# Altium schematic sheet RF_Power.SchDoc
size A4
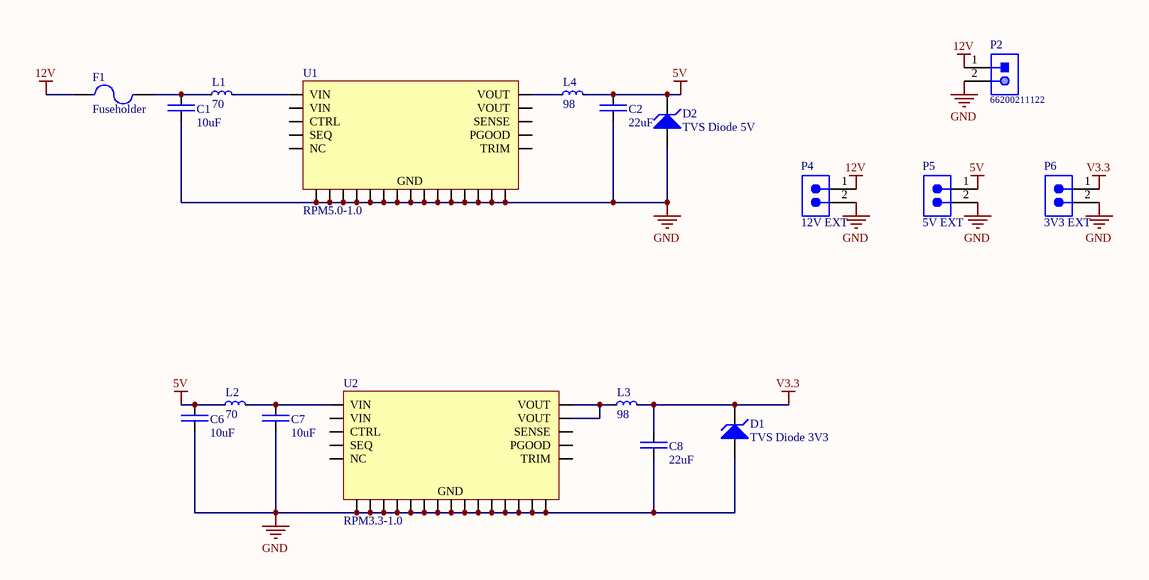
[diagram p0: RF_Power.SchDoc]

## Parts
C1  10uF  [1206]
C2  22uF  [1206]
C6  10uF  [1206]
C7  10uF  [1206]
C8  22uF  [1206]
D1  TVS Diode 3V3  [SOD-323]
D2  TVS Diode 5V  [SOD-323]
F1  Fuseholder  [SCHURTER - 0031.7701.11 - FUSE HOLDER, PCB MOUNT]
L1  70  [1812]
L2  70  [1812]
L3  98  [7427932]
L4  98  [7427932]
P2  66200211122  [66200211122]
P4  12V EXT  [SMTC-TSW-102-26-XX-S]
P5  5V EXT  [SMTC-TSW-102-26-XX-S]
P6  3V3 EXT  [SMTC-TSW-102-26-XX-S]
U1  RPM5.0-1.0  [25-BLGA]
U2  RPM3.3-1.0  [25-BLGA]

## Nets
5V: C2.2 C6.1 D2.2(K) L2.1 L4.2 P5.1
12V: F1.1 P2.1 P4.1
GND: C1.2 C2.1 C6.2 C7.1 C8.1 D1.1(A) D2.1(A) P2.2 P4.2 P5.2 P6.2 U1.A3(GND) U1.A4(GND) U1.B1(GND) U1.B2(GND) U1.B3(GND) U1.B4(GND) U1.C2(GND) U1.C3(GND) U1.C4(GND) U1.D2(GND) U1.D3(GND) U1.D4(GND) U1.D5(GND) U1.E3(GND) U1.E4(GND) U2.A3(GND) U2.A4(GND) U2.B1(GND) U2.B2(GND) U2.B3(GND) U2.B4(GND) U2.C2(GND) U2.C3(GND) U2.C4(GND) U2.D2(GND) U2.D3(GND) U2.D4(GND) U2.D5(GND) U2.E3(GND) U2.E4(GND)
V3.3: C8.2 D1.2(K) L3.2 P6.1
NetC1_1: C1.1 F1.2 L1.1
NetC7_2: C7.2 L2.2 U2.A1(VIN)
NetL1_2: L1.2 U1.A1(VIN)
NetL3_1: L3.1 U2.A5(VOUT) U2.B5(VOUT)
NetL4_1: L4.1 U1.A5(VOUT)

Not connected (* = marked no-connect by the designer): U1 A2(VIN) B5(VOUT) C1(CTRL) C5(SENSE) D1(PGOOD) E1(SEQ) E2(NC) E5(TRIM); U2 A2(VIN) C1(CTRL) C5(SENSE) D1(PGOOD) E1(SEQ) E2(NC) E5(TRIM)

## Library data of the parts
C1 C6 C7 = CL31B106KAHNFNE: CAP CER 10UF 25V X7R 1206; Manufacturer: Samsung; Tolerance: 10%; Supplier 1: Digi-Key; Supplier Part Number 1: 1276-3100-1-ND; Manufacturer Part Number: CL31B106KAHNFNE; RoHS: Yes; Category: Ceramic Capacitors; Stock 1: 1201; Mount: Surface Mount; Case/Package: 1206; Case Code (Metric): 3216; Case Code (Imperial): 1206; Min Operating Temperature: -55°C; Max Operating Temperature: 125°C; Package Quantity: 1; Packaging: Tape and Reel; Capacitance: 10uF; Voltage Rating: 25V; Dielectric: X7R; Length: 3.2mm; Height: 1.6mm; Width: 0.063inch; Thickness: 0.071inch; Depth: 1.6mm; Radiation Hardening: No; Lead Free: Lead Free; ComponentLink1URL: https://datasheet.ciiva.com/25795/cl31b106kahnfne-25795136.pdf?src-supplier=Digi-Key; ComponentLink1Description: https://datasheet.ciiva.com/25795/cl31b106kahnfne-25795136.pdf?src-supplier=Digi-Key
C2 C8 = CL31B226KPHNNNE: CAP CER 22UF 10V X7R 1206; Manufacturer: Samsung; Tolerance: 10%; Supplier 1: Digi-Key; Supplier Part Number 1: 1276-2769-1-ND; Manufacturer Part Number: CL31B226KPHNNNE; RoHS: Yes; Category: Ceramic Capacitors; Stock 1: 617814; Mount: Surface Mount; Case/Package: 1206; Case Code (Metric): 3216; Case Code (Imperial): 1206; Contact Plating: Tin; Min Operating Temperature: -55°C; Max Operating Temperature: 125°C; Package Quantity: 2000; Packaging: Tape and Reel; Capacitance: 22uF; Voltage Rating: 10V; Dielectric: X7R; Voltage Rating (DC): 10V; Termination: Wraparound; Length: 3.2mm; Thickness: 0.071inch; Width: 0.063inch; Depth: 1.6mm; Radiation Hardening: No; Lead Free: Lead Free; ComponentLink1URL: https://datasheet.ciiva.com/25724/cl31b226kphnnne-25724443.pdf?src-supplier=Digi-Key; ComponentLink1Description: https://datasheet.ciiva.com/25724/cl31b226kphnnne-25724443.pdf?src-supplier=Digi-Key; ComponentLink2URL: https://datasheet.ciiva.com/16384/cl31b226kphnnne-16384588.pdf?src-supplier=Future+Electronics; ComponentLink2Description: https://datasheet.ciiva.com/16384/cl31b226kphnnne-16384588.pdf?src-supplier=Future+Electronics; ComponentLink3URL: https://datasheet.ciiva.com/26838/getdatasheetpartid-710483-26838941.pdf?src-supplier=Verical; ComponentLink3Description: https://datasheet.ciiva.com/26838/getdatasheetpartid-710483-26838941.pdf?src-supplier=Verical
D1 = CDSOD323-T03S: ESD Suppressor TVS ±30kV 2-Pin SOD-323 T/R; Manufacturer: Bourns; Direction: Unidirectional; Operating Supply Voltage: 3.3V; Max Surge Current: 43A; Capacitance: 500pF; Number of Unidirectional Channels: 1; Min Breakdown Voltage: 4V; Clamping Voltage: 10.9V; Peak Pulse Power: 500W; Power Line Protection: No; Leakage Current: 125uA; Element Configuration: Single; Supplier 1: Digi-Key; Supplier Part Number 1: CDSOD323-T03SCT-ND; Manufacturer Part Number: CDSOD323-T03S; Stock 1: 99362; Pricing 1: 1 = 0.72000, 10 = 0.60600, 25 = 0.53000, 100 = 0.45420, 250 = 0.39368, 500 = 0.33310, 1000 = 0.25740 (USD); RoHS: Yes; Mount: Surface Mount; Case/Package: SOD-323-2; Number of Pins: 2; Contact Plating: Tin; Min Operating Temperature: -55°C; Max Operating Temperature: 150°C; Packaging: Tape and Reel; Package Quantity: 3000; Reverse Standoff Voltage: 3.3V; Polarity: Unidirectional; Number of Channels: 1; Breakdown Voltage: 4V; Termination: SMD/SMT; Working Voltage: 3.3V; Max Power Dissipation: 500W; Peak Pulse Current: 43A; Composition: Zener; Length: 1.9mm; Depth: 1.45mm; Radiation Hardening: No; REACH SVHC: No SVHC; ComponentLink1URL: https://datasheet.ciiva.com/22685/1671000-22685541.pdf?src-supplier=Element14; ComponentLink1Description: https://datasheet.ciiva.com/22685/1671000-22685541.pdf?src-supplier=Element14; ComponentLink2URL: https://datasheet.ciiva.com/6575/cdsod323-txxsc-6575941.pdf?src-supplier=Digi-Key; ComponentLink2Description: https://datasheet.ciiva.com/6575/cdsod323-txxsc-6575941.pdf?src-supplier=Digi-Key; ComponentLink3URL: https://datasheet.ciiva.com/11193/cdsod323-txxsc-11193742.pdf?src-supplier=Avnet; ComponentLink3Description: https://datasheet.ciiva.com/11193/cdsod323-txxsc-11193742.pdf?src-supplier=Avnet; Category: Circuit Protection
D2 = SD05T1G: TVS DIODE 5V 9.8V SOD323; Manufacturer: ON Semiconductor; Capacitance: 350pF; Direction: Unidirectional; Clamping Voltage: 14.5V; Peak Pulse Power: 350W; Number of Unidirectional Channels: 1; Min Breakdown Voltage: 6.2V; Power Line Protection: No; Peak Pulse Current: 24A; Element Configuration: Single; Breakdown Voltage: 6.75V; Leakage Current: 10uA; Max Breakdown Voltage: 7.3V; Test Current: 1mA; ESD Protection: Yes; Max Power Dissipation: 200mW; Supplier 1: Digi-Key; Supplier Part Number 1: SD05T1GOSCT-ND; Manufacturer Part Number: SD05T1G; Stock 1: 61559; Pricing 1: 1 = 0.49000, 10 = 0.36500, 100 = 0.20680, 500 = 0.13698, 1000 = 0.10502 (USD); RoHS: Yes; Case/Package: SOD-323-2; Number of Pins: 2; Contact Plating: Tin; Min Operating Temperature: -55°C; Max Operating Temperature: 150°C; Packaging: Tape and Reel; Reverse Standoff Voltage: 5V; Working Voltage: 5V; Composition: Zener; Package Quantity: 1; Operating Supply Voltage: 5V; Max Surge Current: 24A; Number of Elements: 1; Reverse Breakdown Voltage: 6.2V; Polarity: Unidirectional; Termination: SMD/SMT; Power Dissipation: 350W; Max Reverse Leakage Current: 10uA; Voltage Rating (DC): 5V; Max Output Current: 24A; Length: 1.7mm; Height: 1mm; Width: 1.35mm; Depth: 1.25mm; Radiation Hardening: No; Lead Free: Lead Free; REACH SVHC: No SVHC; ComponentLink1URL: https://datasheet.ciiva.com/4507/sd05t1-d-241634-4507873.pdf?src-supplier=Mouser; ComponentLink1Description: https://datasheet.ciiva.com/4507/sd05t1-d-241634-4507873.pdf?src-supplier=Mouser; ComponentLink2URL: https://datasheet.ciiva.com/16200/sd05t1-d-16200994.pdf?src-supplier=Future+Electronics; ComponentLink2Description: https://datasheet.ciiva.com/16200/sd05t1-d-16200994.pdf?src-supplier=Future+Electronics; ComponentLink3URL: https://datasheet.ciiva.com/15143/getdatasheetpartid-117154-15143559.pdf?src-supplier=Verical; ComponentLink3Description: https://datasheet.ciiva.com/15143/getdatasheetpartid-117154-15143559.pdf?src-supplier=Verical; ComponentLink4URL: https://datasheet.ciiva.com/30478/0900766b81250bd7-30478714.pdf?src-supplier=RSComponents; ComponentLink4Description: https://datasheet.ciiva.com/30478/0900766b81250bd7-30478714.pdf?src-supplier=RSComponents; ComponentLink5URL: https://datasheet.ciiva.com/339/sd05t1-d-339830.pdf?src-supplier=Digi-Key; ComponentLink5Description: https://datasheet.ciiva.com/339/sd05t1-d-339830.pdf?src-supplier=Digi-Key; ComponentLink6URL: https://datasheet.ciiva.com/339/sd05t1-d-339831.pdf?src-supplier=Digi-Key; ComponentLink6Description: https://datasheet.ciiva.com/339/sd05t1-d-339831.pdf?src-supplier=Digi-Key; ComponentLink7URL: https://datasheet.ciiva.com/11193/sd05t1-d-11193467.pdf?src-supplier=Avnet; ComponentLink7Description: https://datasheet.ciiva.com/11193/sd05t1-d-11193467.pdf?src-supplier=Avnet; ComponentLink8URL: https://datasheet.ciiva.com/22637/1878253-22637228.pdf?src-supplier=Element14; ComponentLink8Description: https://datasheet.ciiva.com/22637/1878253-22637228.pdf?src-supplier=Element14; ComponentLink9URL: https://datasheet.ciiva.com/25956/sd05t1-d-25956638.pdf?src-supplier=Avnet+Europe; ComponentLink9Description: https://datasheet.ciiva.com/25956/sd05t1-d-25956638.pdf?src-supplier=Avnet+Europe; Category: Circuit Protection
F1 = 0031.7701.11: SCHURTER - 0031.7701.11 - FUSE HOLDER, PCB MOUNT; Color: White; Material: Tin; Body Material: Thermoplastic; Current Rating: 5A; Voltage Rating (AC): 125V; Number of Poles: 1; Illumination Type: Illuminated; Supplier 1: Digi-Key; Supplier Part Number 1: 486-1991-ND; Manufacturer: Schurter; Manufacturer Part Number: 0031.7701.11; Stock 1: 11381; Pricing 1: 1 = 1.39000, 50 = 1.03400, 100 = 0.93100, 500 = 0.70300, 1000 = 0.52080 (USD); RoHS: Yes; Mount: Surface Mount; Weight: 0.016932oz; Contact Material: Copper Alloy; Contact Plating: Tin; Terminal Material: Brass; Min Operating Temperature: -40°C; Max Operating Temperature: 85°C; Package Quantity: 100; Packaging: Bulk; Voltage Rating: 125V; Number of Circuits: 1; Termination: SMD/SMT; Voltage: 125V; Fuse Current: 5A; Voltage Rating (DC): 125V; Length: 12mm; Height: 6mm; Width: 5.2mm; Depth: 5.2mm; Radiation Hardening: No; REACH SVHC: No SVHC; Lead Free: Lead Free; ComponentLink1URL: https://datasheet.ciiva.com/1270/typ-omh-125-1270896.pdf?src-supplier=Element14; ComponentLink1Description: https://datasheet.ciiva.com/1270/typ-omh-125-1270896.pdf?src-supplier=Element14; ComponentLink2URL: https://datasheet.ciiva.com/7496/typ-omh-125-7496724.pdf?src-supplier=Digi-Key; ComponentLink2Description: https://datasheet.ciiva.com/7496/typ-omh-125-7496724.pdf?src-supplier=Digi-Key; ComponentLink3URL: https://datasheet.ciiva.com/16215/typ-omh-125-16215096.pdf?src-supplier=Onlinecomponents.com; ComponentLink3Description: https://datasheet.ciiva.com/16215/typ-omh-125-16215096.pdf?src-supplier=Onlinecomponents.com; ComponentLink4URL: https://datasheet.ciiva.com/30058/73typ-omh-125-30058618.pdf?src-supplier=Onlinecomponents.com; ComponentLink4Description: https://datasheet.ciiva.com/30058/73typ-omh-125-30058618.pdf?src-supplier=Onlinecomponents.com; ComponentLink5URL: https://datasheet.ciiva.com/14128/awomh125-data-e-14128364.pdf?src-supplier=Distrelec; ComponentLink5Description: https://datasheet.ciiva.com/14128/awomh125-data-e-14128364.pdf?src-supplier=Distrelec; ComponentLink6URL: https://datasheet.ciiva.com/1221/1925349-1221826.pdf?src-supplier=Newark; ComponentLink6Description: https://datasheet.ciiva.com/1221/1925349-1221826.pdf?src-supplier=Newark; ComponentLink7URL: https://datasheet.ciiva.com/3014/typ-omh-125-3014522.pdf?src-supplier=Avnet; ComponentLink7Description: https://datasheet.ciiva.com/3014/typ-omh-125-3014522.pdf?src-supplier=Avnet; ComponentLink8URL: https://datasheet.ciiva.com/4480/typ-omh-125-4480427.pdf?src-supplier=Mouser; ComponentLink8Description: https://datasheet.ciiva.com/4480/typ-omh-125-4480427.pdf?src-supplier=Mouser; ComponentLink9URL: https://datasheet.ciiva.com/17405/typ-omh-125-17405484.pdf?src-supplier=Avnet+Europe; ComponentLink9Description: https://datasheet.ciiva.com/17405/typ-omh-125-17405484.pdf?src-supplier=Avnet+Europe; Category: Circuit Protection; ComponentLink10Description: Digikey; ComponentLink10URL: https://www.digikey.ca/product-detail/en/schurter-inc/0031.7701.11/486-1991-ND/640027
L1 L2 = 742792510: WURTH ELEKTRONIK - 742792510 - FERRITE BEAD, 70R, 6A, 1812; Manufacturer: Wurth Electronics; Max DC Current: 3mA; DC Resistance (DCR): 30mR; Test Frequency: 100MHz; Number of Lines: 1; Tolerance: 25%; Supplier 1: Digi-Key; Supplier Part Number 1: 732-1640-1-ND; Manufacturer Part Number: 742792510; RoHS: Yes; Category: Ferrite Beads and Chips; Stock 1: 5974; Mount: Surface Mount; Case/Package: SMD/SMT; Weight: 0.003951oz; Case Code (Imperial): 1812; Case Code (Metric): 4532; Material: Ferrite; Min Operating Temperature: -55°C; Max Operating Temperature: 125°C; Max Current Rating: 6A; Termination: SMD/SMT; Package Quantity: 1; Packaging: Tape and Reel; Current Rating: 6A; Impedance: 70R; Resistance: 30mR; Length: 4.5mm; Height: 1.5mm; Depth: 3.2mm; Width: 3.2mm; Lead Free: Lead Free; REACH SVHC: Unknown; ComponentLink1URL: https://datasheet.ciiva.com/1475/1695992-1475250.pdf?src-supplier=Farnell; ComponentLink1Description: https://datasheet.ciiva.com/1475/1695992-1475250.pdf?src-supplier=Farnell; ComponentLink2URL: https://datasheet.ciiva.com/11803/0900766b80bbd134-11803157.pdf?src-supplier=RSComponents; ComponentLink2Description: https://datasheet.ciiva.com/11803/0900766b80bbd134-11803157.pdf?src-supplier=RSComponents; ComponentLink3URL: https://datasheet.ciiva.com/23762/742792510-23762981.pdf?src-supplier=Newark; ComponentLink3Description: https://datasheet.ciiva.com/23762/742792510-23762981.pdf?src-supplier=Newark; ComponentLink4URL: https://datasheet.ciiva.com/4940/742792510-72179-4940456.pdf?src-supplier=Mouser; ComponentLink4Description: https://datasheet.ciiva.com/4940/742792510-72179-4940456.pdf?src-supplier=Mouser; ComponentLink5URL: https://datasheet.ciiva.com/1013/742792510-1013644.pdf?src-supplier=Digi-Key; ComponentLink5Description: https://datasheet.ciiva.com/1013/742792510-1013644.pdf?src-supplier=Digi-Key; ComponentLink6URL: https://datasheet.ciiva.com/1013/742792510-1013645.pdf?src-supplier=Digi-Key; ComponentLink6Description: https://datasheet.ciiva.com/1013/742792510-1013645.pdf?src-supplier=Digi-Key; ComponentLink7URL: https://datasheet.ciiva.com/1126/1695992-1126824.pdf?src-supplier=Element14; ComponentLink7Description: https://datasheet.ciiva.com/1126/1695992-1126824.pdf?src-supplier=Element14; ComponentLink8URL: https://datasheet.ciiva.com/1013/742792510-1013646.pdf?src-supplier=Digi-Key; ComponentLink8Description: https://datasheet.ciiva.com/1013/742792510-1013646.pdf?src-supplier=Digi-Key
L3 L4 = 7427932: Ferrite Bead 98 Ohm 2SMD 1LN; Manufacturer: Wurth Electronics; DC Resistance (DCR): 0.9mR; Max DC Current: 6A; Tolerance: 25%; Shielding: Unshielded; Number of Lines: 1; Test Frequency: 100MHz; Impedance: 98R; Supplier 1: Digi-Key; Supplier Part Number 1: 732-2394-1-ND; Manufacturer Part Number: 7427932; RoHS: Yes; Category: Ferrite Beads and Chips; Stock 1: 698; Mount: Surface Mount; Case/Package: SMD/SMT; Case Code (Metric): 4532; Case Code (Imperial): 1812; Min Operating Temperature: -55°C; Max Operating Temperature: 125°C; Termination: SMD/SMT; Package Quantity: 1; Packaging: Tape and Reel; Max Current Rating: 6A; Length: 7.8mm; Height: 3mm; Depth: 4.75mm; Width: 0.187inch; REACH SVHC: Unknown; ComponentLink1URL: https://datasheet.ciiva.com/1014/7427932-1014097.pdf?src-supplier=Digi-Key; ComponentLink1Description: https://datasheet.ciiva.com/1014/7427932-1014097.pdf?src-supplier=Digi-Key; ComponentLink2URL: https://datasheet.ciiva.com/1466/1696119-1466626.pdf?src-supplier=Element14; ComponentLink2Description: https://datasheet.ciiva.com/1466/1696119-1466626.pdf?src-supplier=Element14; ComponentLink3URL: https://datasheet.ciiva.com/11796/0900766b80f886b0-11796146.pdf?src-supplier=RSComponents; ComponentLink3Description: https://datasheet.ciiva.com/11796/0900766b80f886b0-11796146.pdf?src-supplier=RSComponents; ComponentLink4URL: https://datasheet.ciiva.com/23763/7427932-23763047.pdf?src-supplier=Newark; ComponentLink4Description: https://datasheet.ciiva.com/23763/7427932-23763047.pdf?src-supplier=Newark; ComponentLink5URL: https://datasheet.ciiva.com/4939/7427932-72413-4939403.pdf?src-supplier=Mouser; ComponentLink5Description: https://datasheet.ciiva.com/4939/7427932-72413-4939403.pdf?src-supplier=Mouser; ComponentLink6URL: https://datasheet.ciiva.com/1014/7427932-1014098.pdf?src-supplier=Digi-Key; ComponentLink6Description: https://datasheet.ciiva.com/1014/7427932-1014098.pdf?src-supplier=Digi-Key; ComponentLink7URL: https://datasheet.ciiva.com/1014/7427932-1014099.pdf?src-supplier=Digi-Key; ComponentLink7Description: https://datasheet.ciiva.com/1014/7427932-1014099.pdf?src-supplier=Digi-Key; ComponentLink8URL: https://datasheet.ciiva.com/22711/1696119-22711445.pdf?src-supplier=Element14; ComponentLink8Description: https://datasheet.ciiva.com/22711/1696119-22711445.pdf?src-supplier=Element14
P2 = CMP-1502-00440-1: THT Male Header WR-MPC3, Vertical, Single Row, pitch 3 mm, 2 pins; Manufacturer: Wurth Elektronik; Contact Resistance: 10mOhm; Pin Number: 2; Working Voltage: 250VAC; Pitch: 3mm; Orientation: Vertical; Mounting Technology: THT; Packaging: Tube; Publisher: WurthElektronik; Operating Temperature: -40to105degC; Datasheet URL: https://katalog.we-online.de/em/datasheet/6620xx11122.pdf; Manufacturer URL: http://www.we-online.de; Part Number: 66200211122; Gender: Male; Package Reference: 66200211122
P4-P6 = CMP-1024-00327-1: 0.025" SQ Post Header, Through-hole, Vertical, -55 to 125 degC, 2.54 mm Pitch, 2-Pin, Male, RoHS; PartNumber: TSW-102-26-G-S; Manufacturer: Samtec; Pitch: 2.54 mm; Orientation: Vertical; ComponentLink3Description: Package Specification; PackageReference: TSW-102-26-XX-S; Mounting Technology: Through-hole; ComponentLink2Description: Datasheet; ComponentLink1URL: http://www.samtec.com; DatasheetVersion: F-214; ComponentLink1Description: Manufacturer URL; RoHS: True; ComponentLink2URL: http://www.samtec.com/documents/webfiles/pdf/TSW_TH.PDF; ComponentLink3URL: http://www.samtec.com/documents/webfiles/cpdf/TSW-XXX-XX-XXX-X-XX-XXX-MKT.pdf; PackageDescription: .025[0.64] SQ. Post Terminal Strip Assembly; PackageVersion: DM, 8/1988; Temperature Range: -55 to 125 degC
U1 = RPM5.0-1.0: 1A DC/DC-CONVERTER INNOLINE SM; Manufacturer: Recom; Supplier 1: Digi-Key; Supplier Part Number 1: 945-3250-1-ND; Manufacturer Part Number: RPM5.0-1.0; RoHS: No; Stock 1: 175; ComponentLink1URL: https://www.recom-power.com/pdf/Innoline/RPM-1.0.pdf?src-supplier=Digi-Key; ComponentLink1Description: https://www.recom-power.com/pdf/Innoline/RPM-1.0.pdf?src-supplier=Digi-Key
U2 = RPM3.3-1.0: 1A DC/DC-CONVERTER INNOLINE SM; Manufacturer: Recom; Supplier 1: Digi-Key; Supplier Part Number 1: 945-3249-1-ND; Manufacturer Part Number: RPM3.3-1.0; RoHS: No; Stock 1: 319; ComponentLink1URL: https://www.recom-power.com/pdf/Innoline/RPM-1.0.pdf?src-supplier=Digi-Key; ComponentLink1Description: https://www.recom-power.com/pdf/Innoline/RPM-1.0.pdf?src-supplier=Digi-Key